# EAGLE design sensor-input (EAGLE 7.7.0)
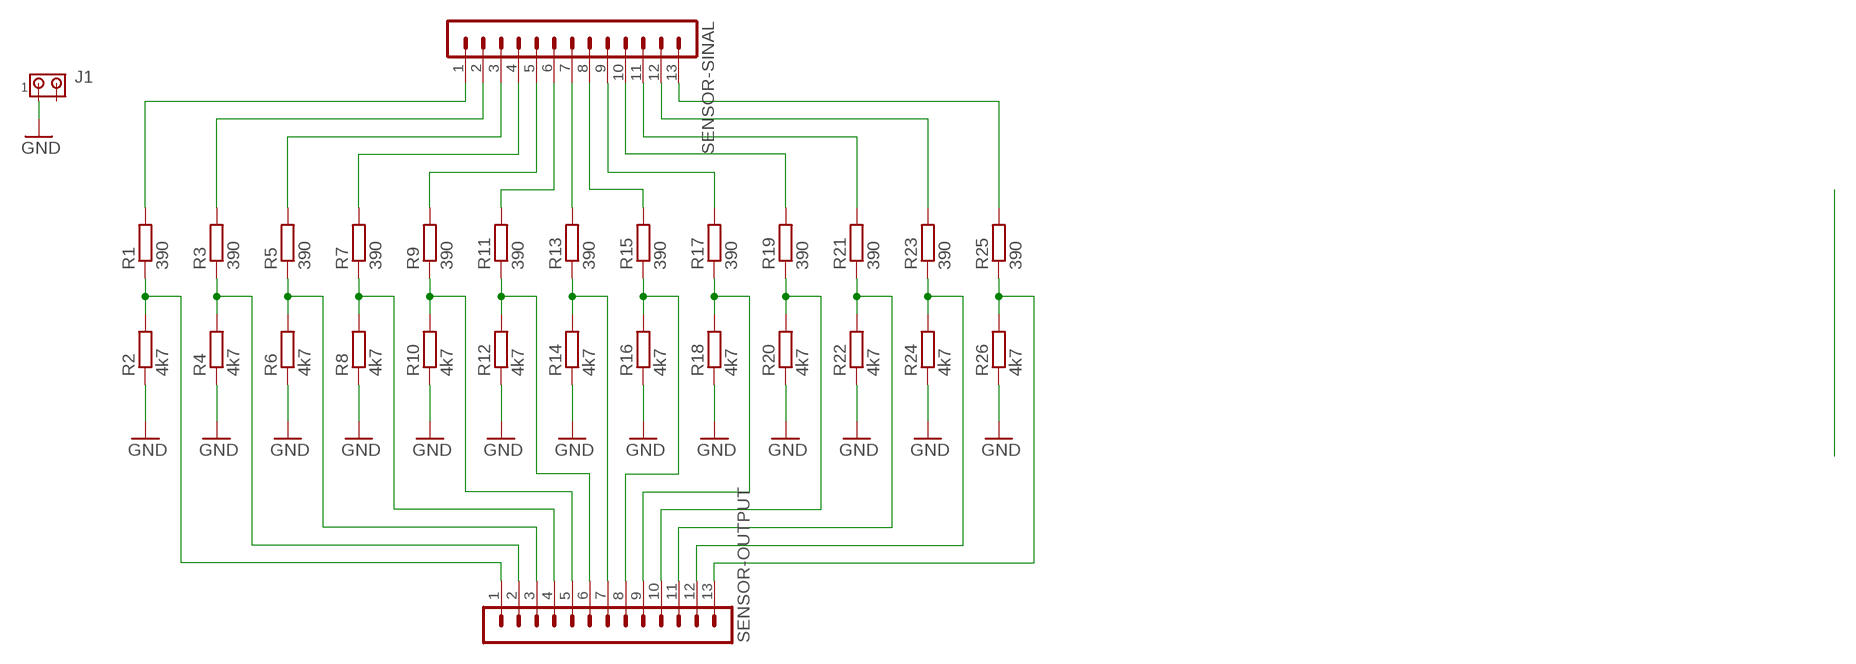
[diagram p0: schematic, sheet 1]

## Parts
J1  MTA02-100  [10X02MTA]
R1  390  R-EU_0207/7  [0207/7]
R2  4k7  R-EU_0207/7  [0207/7]
R3  390  R-EU_0207/7  [0207/7]
R4  4k7  R-EU_0207/7  [0207/7]
R5  390  R-EU_0207/7  [0207/7]
R6  4k7  R-EU_0207/7  [0207/7]
R7  390  R-EU_0207/7  [0207/7]
R8  4k7  R-EU_0207/7  [0207/7]
R9  390  R-EU_0207/7  [0207/7]
R10  4k7  R-EU_0207/7  [0207/7]
R11  390  R-EU_0207/7  [0207/7]
R12  4k7  R-EU_0207/7  [0207/7]
R13  390  R-EU_0207/7  [0207/7]
R14  4k7  R-EU_0207/7  [0207/7]
R15  390  R-EU_0207/7  [0207/7]
R16  4k7  R-EU_0207/7  [0207/7]
R17  390  R-EU_0207/7  [0207/7]
R18  4k7  R-EU_0207/7  [0207/7]
R19  390  R-EU_0207/7  [0207/7]
R20  4k7  R-EU_0207/7  [0207/7]
R21  390  R-EU_0207/7  [0207/7]
R22  4k7  R-EU_0207/7  [0207/7]
R23  390  R-EU_0207/7  [0207/7]
R24  4k7  R-EU_0207/7  [0207/7]
R25  390  R-EU_0207/7  [0207/7]
R26  4k7  R-EU_0207/7  [0207/7]
SENSOR-OUTPUT  MA13-1  [MA13-1]
SENSOR-SINAL  MA13-1  [MA13-1]

## Nets
GND: J1.1 R2.1 R4.1 R6.1 R8.1 R10.1 R12.1 R14.1 R16.1 R18.1 R20.1 R22.1 R24.1 R26.1
N$1: R3.1 R4.2 SENSOR-OUTPUT.2
N$2: R1.1 R2.2 SENSOR-OUTPUT.1
N$3: R5.1 R6.2 SENSOR-OUTPUT.3
N$4: R7.1 R8.2 SENSOR-OUTPUT.4
N$5: R9.1 R10.2 SENSOR-OUTPUT.5
N$6: R11.1 R12.2 SENSOR-OUTPUT.6
N$7: R13.1 R14.2 SENSOR-OUTPUT.7
N$8: R15.1 R16.2 SENSOR-OUTPUT.8
N$9: R17.1 R18.2 SENSOR-OUTPUT.9
N$10: R19.1 R20.2 SENSOR-OUTPUT.10
N$11: R21.1 R22.2 SENSOR-OUTPUT.11
N$12: R23.1 R24.2 SENSOR-OUTPUT.12
N$13: R25.1 R26.2 SENSOR-OUTPUT.13
N$14: R1.2 SENSOR-SINAL.1
N$15: R3.2 SENSOR-SINAL.2
N$16: R5.2 SENSOR-SINAL.3
N$17: R7.2 SENSOR-SINAL.4
N$18: R9.2 SENSOR-SINAL.5
N$19: R11.2 SENSOR-SINAL.6
N$20: R13.2 SENSOR-SINAL.7
N$21: R15.2 SENSOR-SINAL.8
N$22: R17.2 SENSOR-SINAL.9
N$23: R19.2 SENSOR-SINAL.10
N$24: R21.2 SENSOR-SINAL.11
N$25: R23.2 SENSOR-SINAL.12
N$26: R25.2 SENSOR-SINAL.13
Unconnected: J1.2

## Library data of the parts
J1 = con-amp:MTA02-100: AMP connector
R1-R26 = resistor:R-EU_: RESISTOR, European symbol
SENSOR-OUTPUT SENSOR-SINAL = con-lstb:MA13-1: PIN HEADER; OC_FARNELL: unknown; OC_NEWARK: unknown

## Board
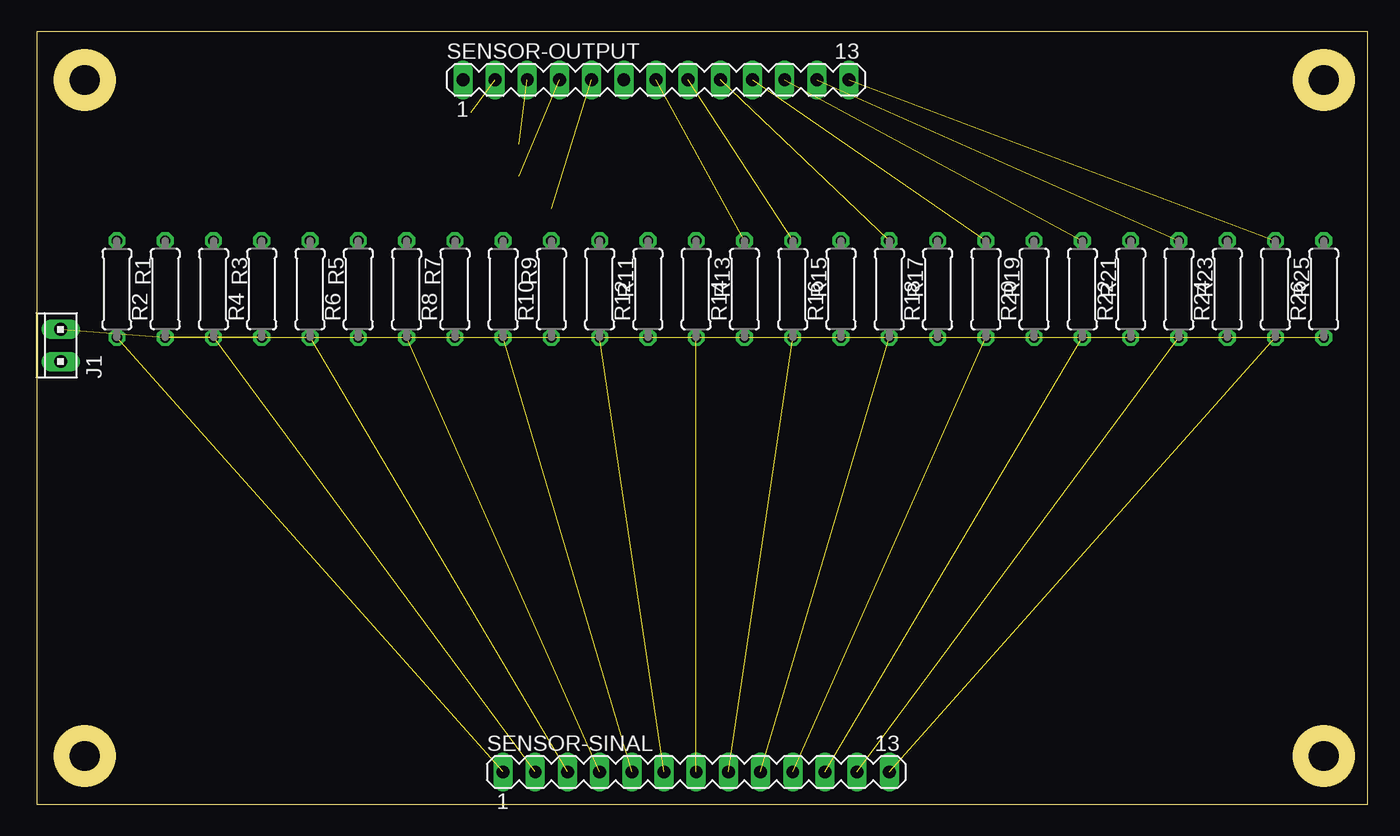
[diagram p1: board, top side]
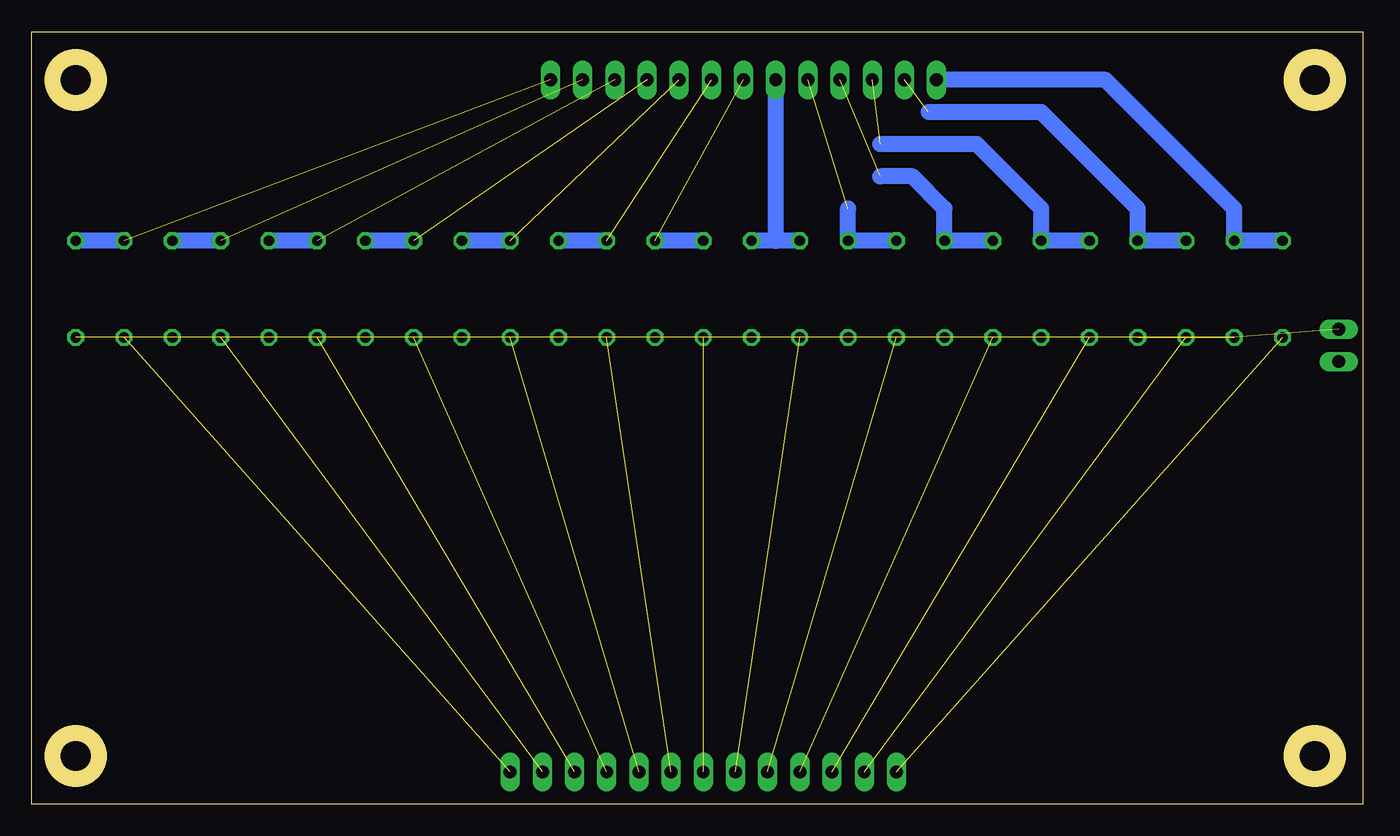
[diagram p2: board, bottom side, seen from below]

Size 105.08 x 60.95 mm. Coordinates in mm from the lower left corner, seen from the top.
Outline: 0,0 105.08,0 105.08,60.95 0,60.95 0,0
Outline: circle at 3.81,57.15 radius 1.8
Outline: circle at 3.81,3.81 radius 1.8
Outline: circle at 101.6,3.81 radius 1.8
Outline: circle at 101.6,57.15 radius 1.8
Copper layers (1*16): Top 0.035mm / dielectric 1.5mm / Bottom 0.035mm
Design rules "default": minimum track width 10mil, minimum drill 24mil, track to track 8mil, track to pad 8mil, pad to pad 8mil, via to via 8mil, smd to smd 8mil, copper to edge 40mil, drill to drill 8mil, minimum pad ring 10mil, minimum via ring 8mil, stop-mask expansion 4mil, vias tented up to drill 0mil, thermal gap 10mil

### Footprints (pad centres in the part's own frame; a part is rotated, then mirrored left to right if it is on the bottom)
10X02MTA = drill 1.016 long: 1 1.27,0; 2 -1.27,0
0207/7 = drill 0.813 octagon: 1 -3.81,0; 2 3.81,0
MA13-1 = drill 1.016 long: 1 -15.24,0; 2 -12.7,0; 3 -10.16,0; 4 -7.62,0; 5 -5.08,0; 6 -2.54,0; 7 0,0; 8 2.54,0; 9 5.08,0; 10 7.62,0; 11 10.16,0; 12 12.7,0; 13 15.24,0

### Placement (x,y rotation side)
J1  1.91,36.2 90 top
R1  6.35,40.64 270 top
R2  10.16,40.64 90 top
R3  13.97,40.64 270 top
R4  17.78,40.64 90 top
R5  21.59,40.64 270 top
R6  25.4,40.64 90 top
R7  29.21,40.64 270 top
R8  33.02,40.64 90 top
R9  36.83,40.64 270 top
R10  40.64,40.64 90 top
R11  44.45,40.64 270 top
R12  48.26,40.64 90 top
R13  52.07,40.64 270 top
R14  55.88,40.64 90 top
R15  59.69,40.64 270 top
R16  63.5,40.64 90 top
R17  67.31,40.64 270 top
R18  71.12,40.64 90 top
R19  74.93,40.64 270 top
R20  78.74,40.64 90 top
R21  82.55,40.64 270 top
R22  86.36,40.64 90 top
R23  90.17,40.64 270 top
R24  93.98,40.64 90 top
R25  97.79,40.64 270 top
R26  101.6,40.64 90 top
SENSOR-OUTPUT  48.9,57.15 0 top
SENSOR-SINAL  52.07,2.54 0 top

### Tracks (layer width: path | path; a pad name or v marks a point on that pad's centre or on a via)
GND  (13 unrouted)
N$1  (1 unrouted)
  Bottom 1.27: R3.1 R4.2 17.78,46.99 25.4,54.61 34.29,54.61
N$2
  Bottom 1.27: R1.1 R2.2 10.16,46.99 20.32,57.15 SENSOR-OUTPUT.1
N$3  (1 unrouted)
  Bottom 1.27: R5.1 R6.2 25.4,46.99 30.48,52.07 38.1,52.07
N$4  (1 unrouted)
  Bottom 1.27: R7.1 R8.2 33.02,46.99 35.56,49.53 38.1,49.53
N$5  (1 unrouted)
  Bottom 1.27: R9.1 R10.2 40.64,46.99
N$6
  Bottom 1.27: R11.1 46.35,44.45 | 46.35,44.45 R12.2 | SENSOR-OUTPUT.6 46.35,44.45
N$7  (1 unrouted)
  Bottom 1.27: R13.1 R14.2
N$8  (1 unrouted)
  Bottom 1.27: R15.1 R16.2
N$9  (1 unrouted)
  Bottom 1.27: R17.1 R18.2
N$10  (1 unrouted)
  Bottom 1.27: R19.1 R20.2
N$11  (1 unrouted)
  Bottom 1.27: R21.1 R22.2
N$12  (1 unrouted)
  Bottom 1.27: R23.1 R24.2
N$13  (1 unrouted)
  Bottom 1.27: R25.1 R26.2
N$14  (1 unrouted)
N$15  (1 unrouted)
N$16  (1 unrouted)
N$17  (1 unrouted)
N$18  (1 unrouted)
N$19  (1 unrouted)
N$20  (1 unrouted)
N$21  (1 unrouted)
N$22  (1 unrouted)
N$23  (1 unrouted)
N$24  (1 unrouted)
N$25  (1 unrouted)
N$26  (1 unrouted)